# EAGLE design STM32F05_V2 (EAGLE 7.5.0)
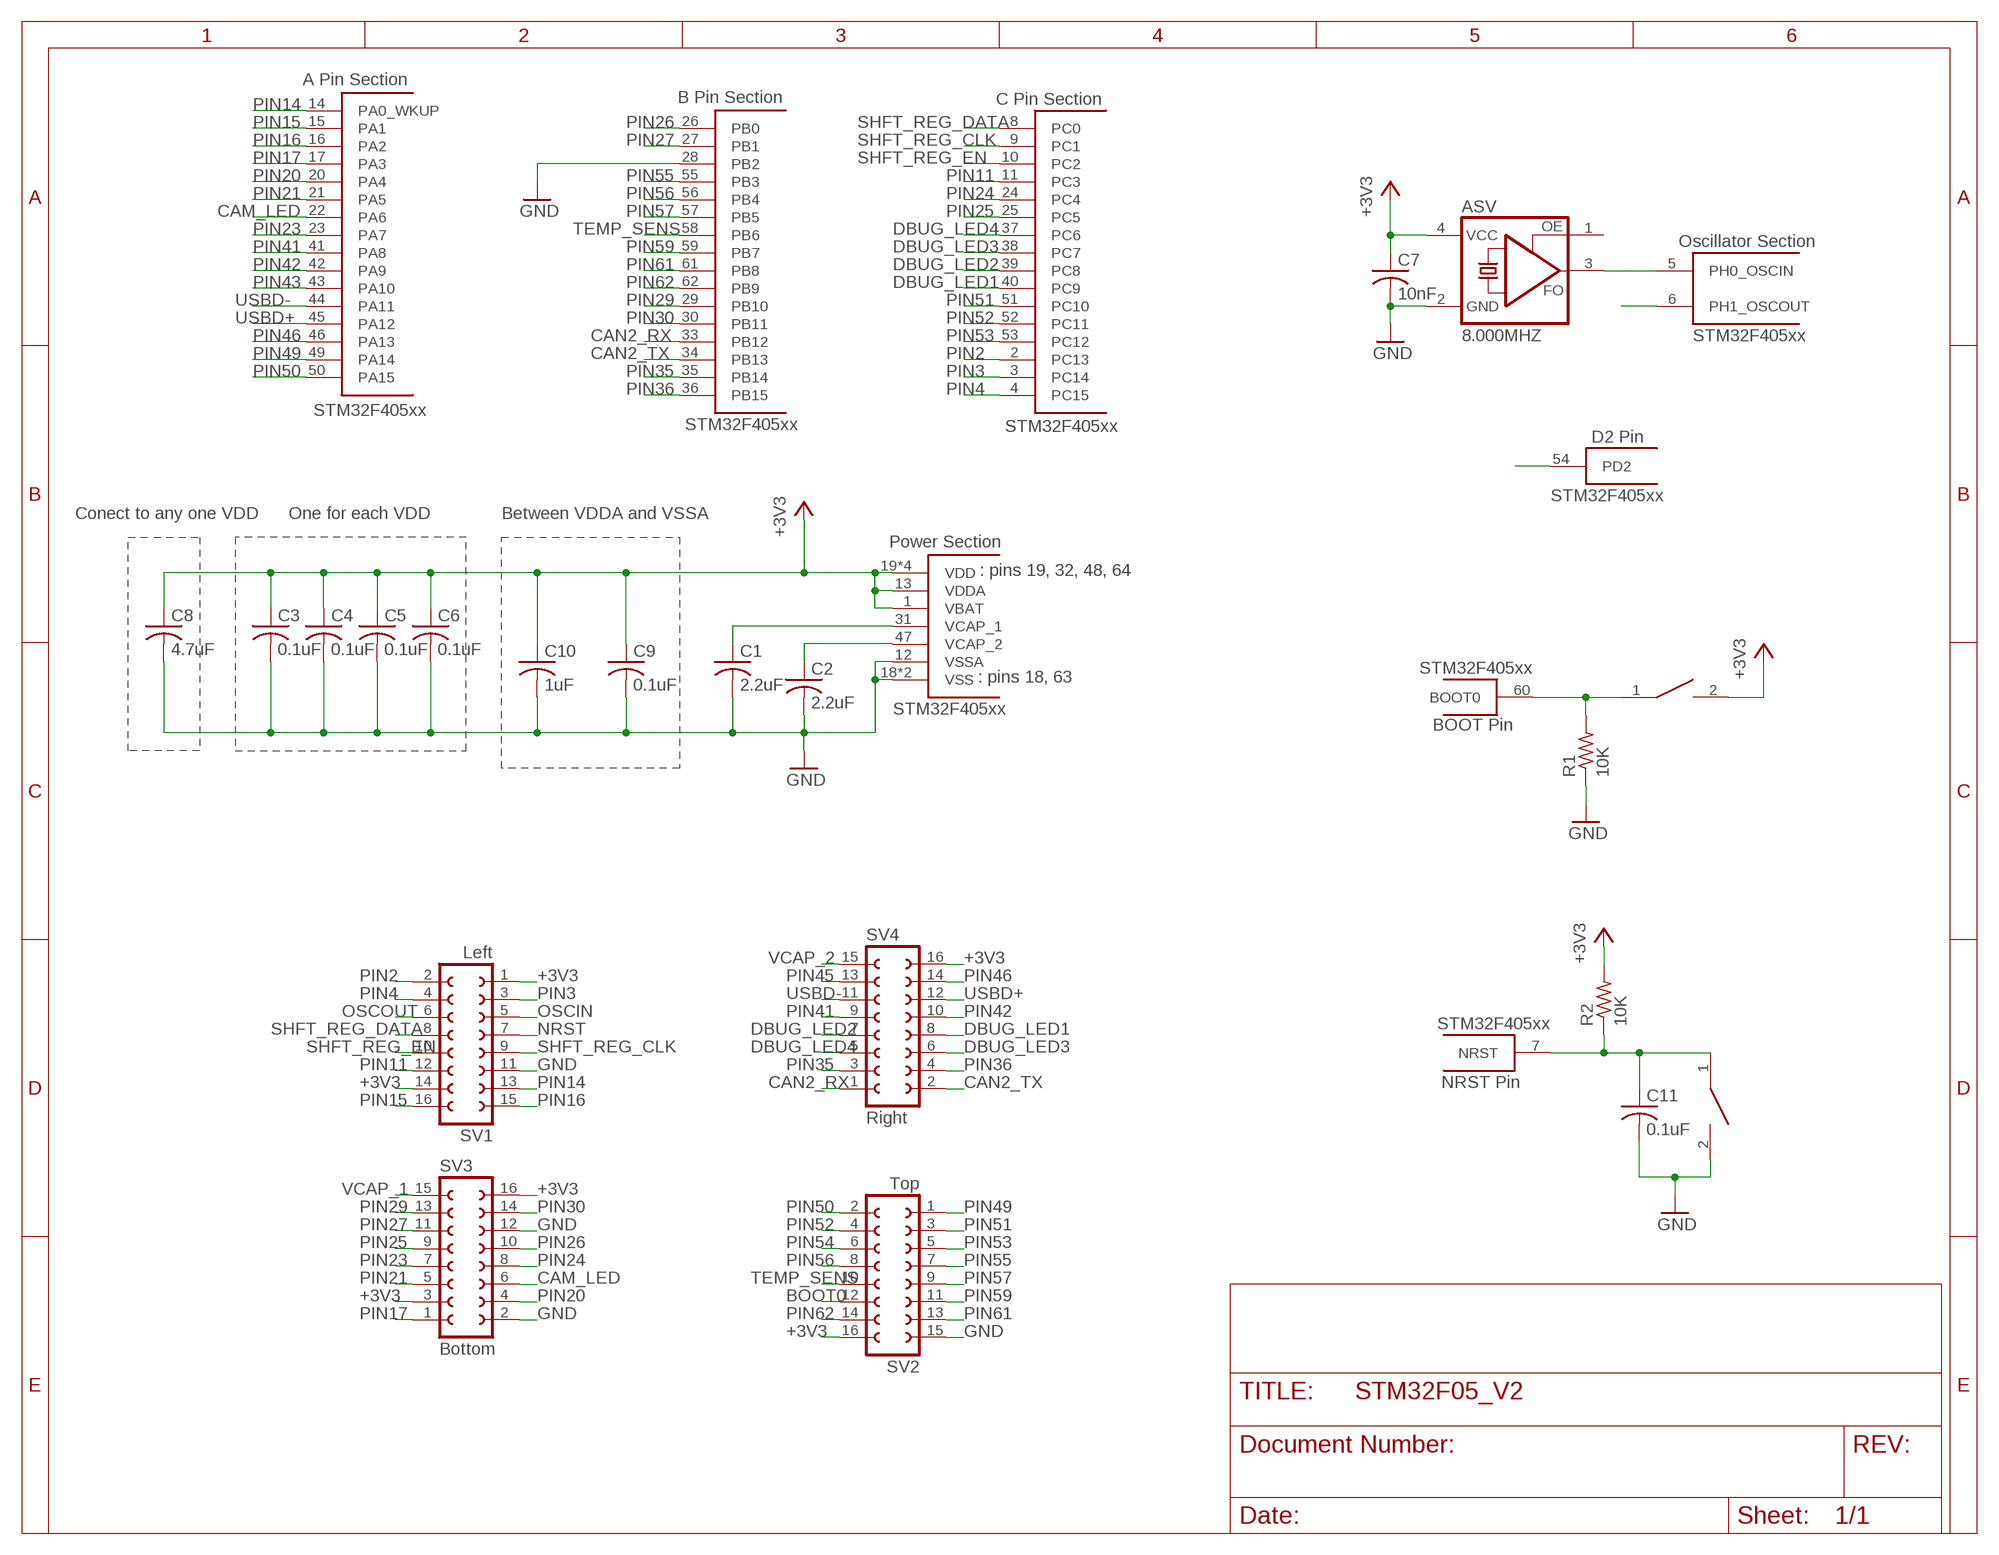
[diagram p0: schematic, sheet 1, part 1 of 2]
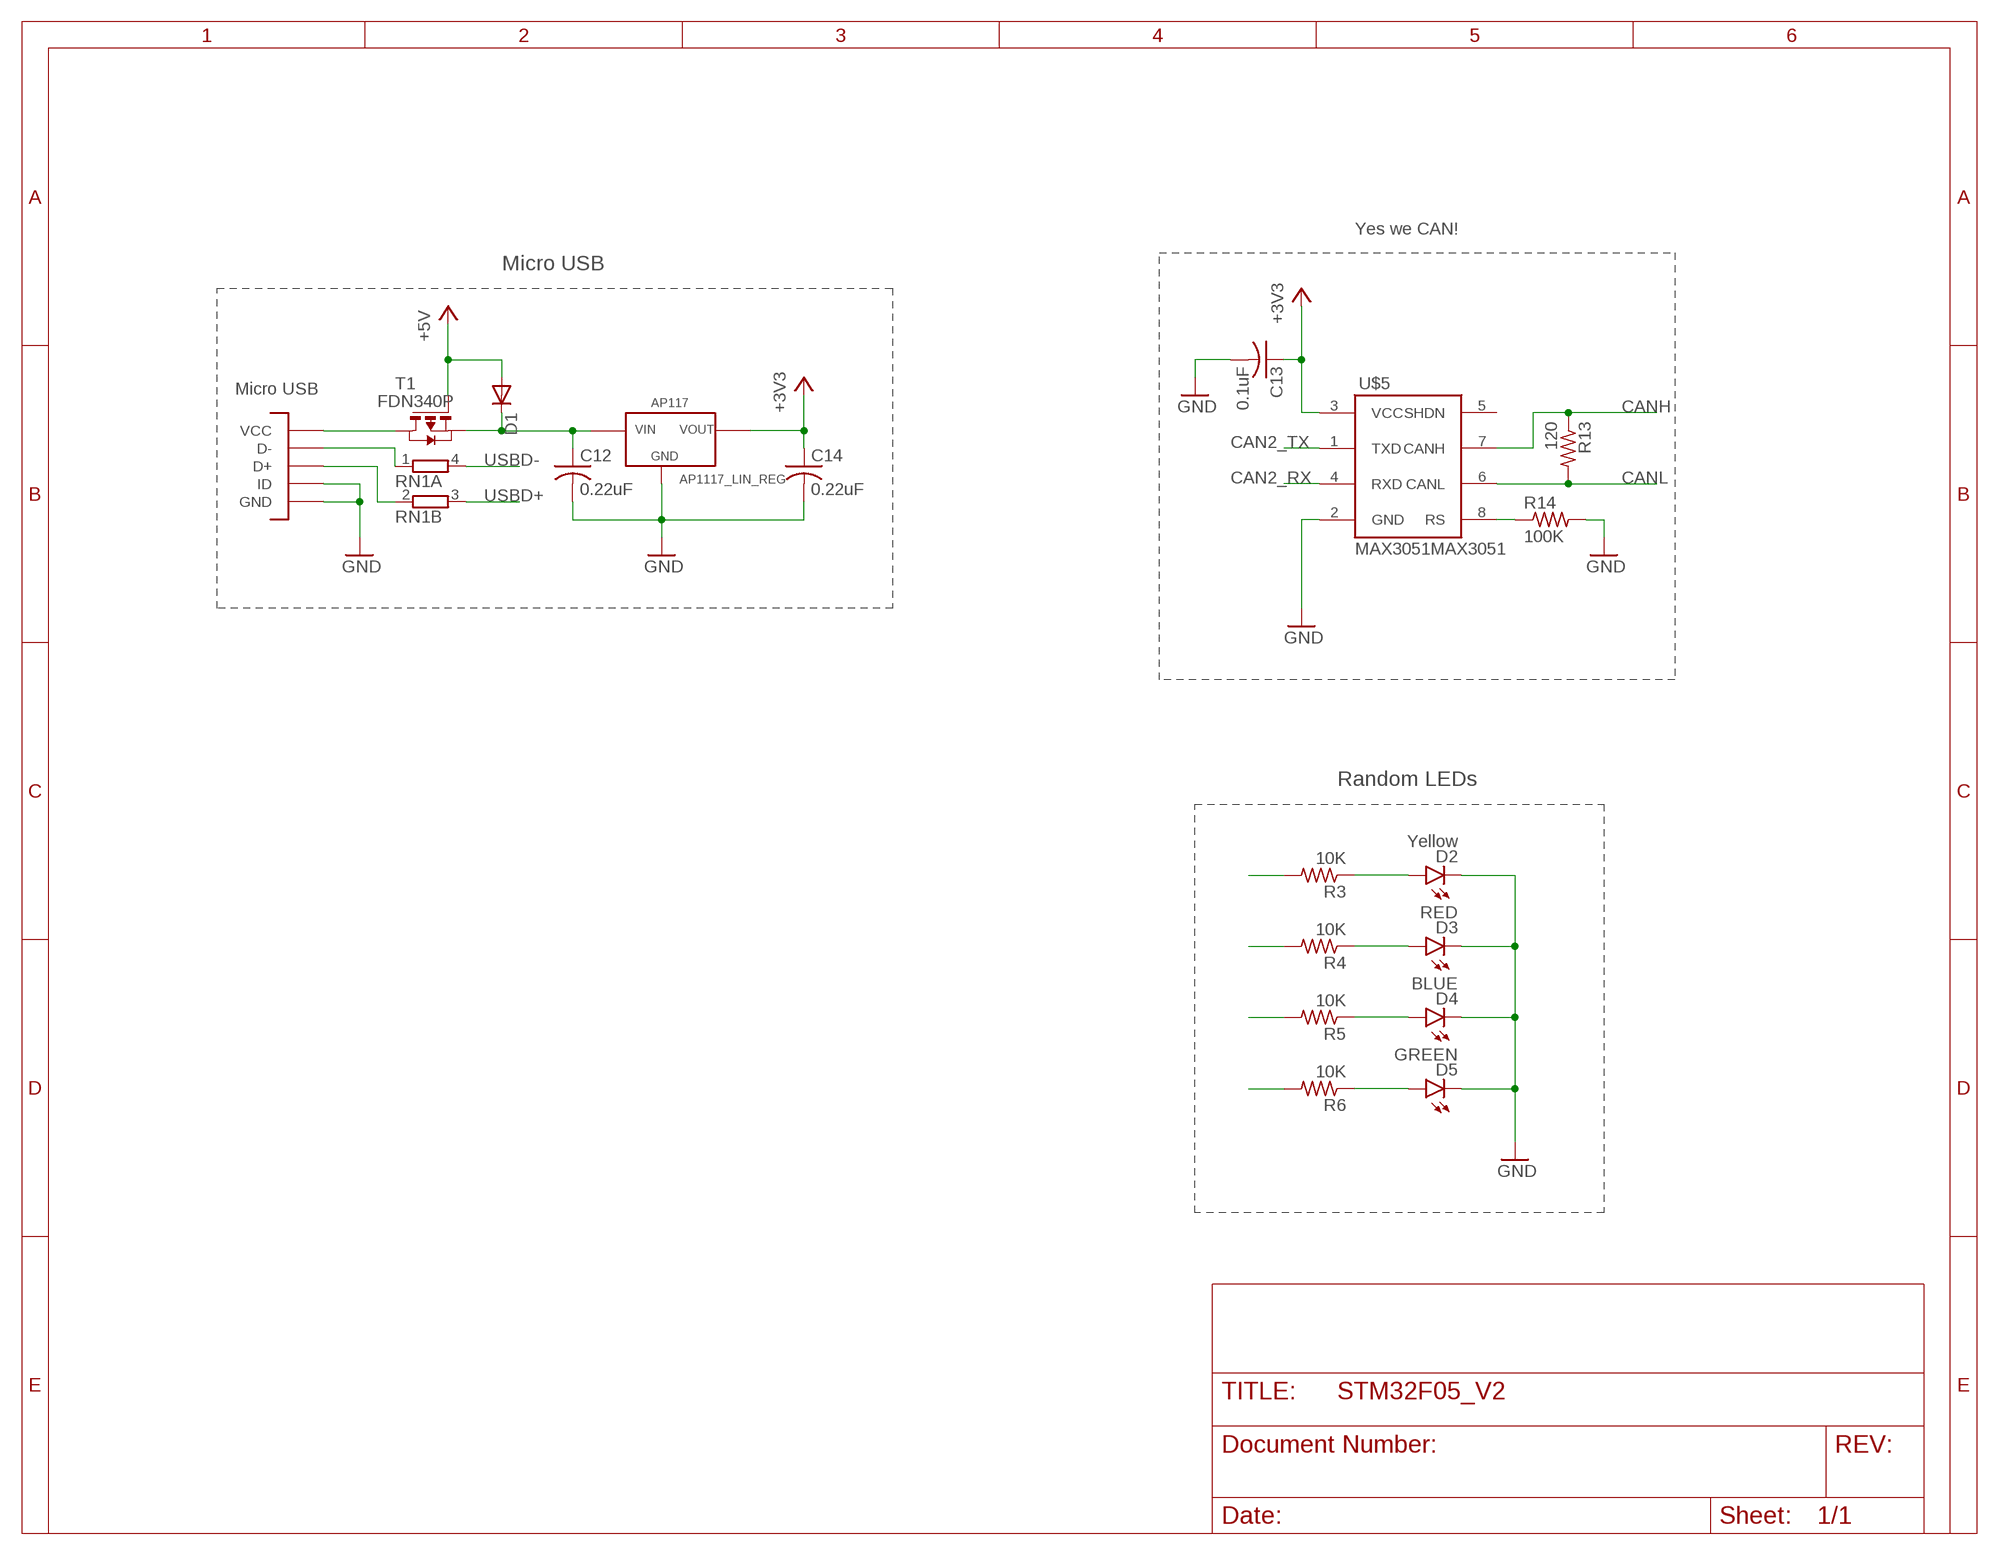
[diagram p1: schematic, sheet 1, part 2 of 2]

## Parts
ASV  8.000MHZ  ASF  [ASF]
C1  2.2uF  C-USC0603  [C0603]
C2  2.2uF  C-USC0603  [C0603]
C3  0.1uF  C-USC0603  [C0603]
C4  0.1uF  C-USC0603  [C0603]
C5  0.1uF  C-USC0603  [C0603]
C6  0.1uF  C-USC0603  [C0603]
C7  10nF  C-USC0603  [C0603]
C8  4.7uF  C-USC0603  [C0603]
C9  0.1uF  C-USC0603  [C0603]
C10  1uF  C-USC0603  [C0603]
C11  0.1uF  C-USC0603  [C0603]
C12  0.22uF  C-USC0603  [C0603]
C13  0.1uF  C-USC0603  [C0603]
C14  0.22uF  C-USC0603  [C0603]
D1  DIODE-DO-214AC  [DO-214AC]
D2  Yellow  LED-YELLOW0603  [LED-0603]
D3  RED  LED-RED0603  [LED-0603]
D4  BLUE  LED-BLUE0603  [LED-0603]
D5  GREEN  LED-GREEN0603  [LED-0603]
R1  10K  R-US_R0603  [R0603]
R2  10K  R-US_R0603  [R0603]
R3  10K  R-US_R0603  [R0603]
R4  10K  R-US_R0603  [R0603]
R5  10K  R-US_R0603  [R0603]
R6  10K  R-US_R0603  [R0603]
R13  120  R-US_R0603  [R0603]
R14  100K  R-US_R0603  [R0603]
RN1  2R-NEXBV4V  [EXBV4V]
SV1  Left  FE08-2  [FE08-2]
SV2  Top  FE08-2  [FE08-2]
SV3  Bottom  FE08-2  [FE08-2]
SV4  Right  FE08-2  [FE08-2]
T1  FDN340P  [SOT-23]
T2  AP1117_LIN_REG  [SOT223]
U$1  STM32F405  [LQFP64]
U$2  SWITCH  [SW_2512]
U$3  SWITCH  [SW_2512]
U$4  MICROUSB  [MICRO_B]
U$5  MAX3051MAX3051  [SOT23-8L]

## Nets
+3V3: ASV.4(VCC) C3.1 C4.1 C5.1 C6.1 C7.1 C8.1 C9.1 C10.1 C13.1 C14.1 R2.2 SV1.1 SV1.14 SV2.16 SV3.3 SV3.16 SV4.16 T2.TAB(VOUT) T2.VOUT U$1.1(VBAT) U$1.13(VDDA) U$1.19(VDD) U$1.32(VDD) U$1.48(VDD) U$1.64(VDD) U$2.2 U$5.3(VCC)
+5V: D1.A T1.3(G)
BOOT0: R1.2 SV2.12 U$1.60(BOOT0) U$2.1
CAM_LED: SV3.6 U$1.22(PA6)
CAN2_RX: SV4.1 U$1.33(PB12) U$5.4(RXD)
CAN2_TX: SV4.2 U$1.34(PB13) U$5.1(TXD)
CANH: R13.1 U$5.7(CANH)
CANL: R13.2 U$5.6(CANL)
DBUG_LED1: R3.2 SV4.8 U$1.40(PC9)
DBUG_LED2: R4.2 SV4.7 U$1.39(PC8)
DBUG_LED3: R5.2 SV4.6 U$1.38(PC7)
DBUG_LED4: R6.2 SV4.5 U$1.37(PC6)
GND: ASV.2(GND) C1.2 C2.2 C3.2 C4.2 C5.2 C6.2 C7.2 C8.2 C9.2 C10.2 C11.2 C12.2 C13.2 C14.2 D2.C D3.C D4.C D5.C R1.1 R14.2 SV1.11 SV2.15 SV3.2 SV3.12 T2.GND U$1.12(VSSA) U$1.18(VSS) U$1.28(PB2) U$1.63(VSS) U$3.2 U$4.GND1(GND) U$4.GND2(GND) U$4.GND3(GND) U$4.GND4(GND) U$4.GND7(GND) U$4.GND8(GND) U$4.P4(ID) U$4.P5(GND) U$5.2(GND)
N$1: RN1.1 U$4.P2(D-)
N$24: RN1.2 U$4.P3(D+)
N$57: T1.1(D) U$4.P1(VCC)
N$58: C12.1 D1.C T1.2(S) T2.VIN
N$59: D2.A R3.1
N$60: D3.A R4.1
N$61: D4.A R5.1
N$62: D5.A R6.1
N$63: R14.1 U$5.8(RS)
NRST: C11.1 R2.1 SV1.7 U$1.7(NRST) U$3.1
OSCIN: ASV.3(FO) SV1.5 U$1.5(PH0_OSCIN)
OSCOUT: SV1.6 U$1.6(PH1_OSCOUT)
PIN2: SV1.2 U$1.2(PC13)
PIN3: SV1.3 U$1.3(PC14)
PIN4: SV1.4 U$1.4(PC15)
PIN11: SV1.12 U$1.11(PC3)
PIN14: SV1.13 U$1.14(PA0_WKUP)
PIN15: SV1.16 U$1.15(PA1)
PIN16: SV1.15 U$1.16(PA2)
PIN17: SV3.1 U$1.17(PA3)
PIN20: SV3.4 U$1.20(PA4)
PIN21: SV3.5 U$1.21(PA5)
PIN23: SV3.7 U$1.23(PA7)
PIN24: SV3.8 U$1.24(PC4)
PIN25: SV3.9 U$1.25(PC5)
PIN26: SV3.10 U$1.26(PB0)
PIN27: SV3.11 U$1.27(PB1)
PIN29: SV3.13 U$1.29(PB10)
PIN30: SV3.14 U$1.30(PB11)
PIN35: SV4.3 U$1.35(PB14)
PIN36: SV4.4 U$1.36(PB15)
PIN41: SV4.9 U$1.41(PA8)
PIN42: SV4.10 U$1.42(PA9)
PIN43: U$1.43(PA10)
PIN45: SV4.13
PIN46: SV4.14 U$1.46(PA13)
PIN49: SV2.1 U$1.49(PA14)
PIN50: SV2.2 U$1.50(PA15)
PIN51: SV2.3 U$1.51(PC10)
PIN52: SV2.4 U$1.52(PC11)
PIN53: SV2.5 U$1.53(PC12)
PIN54: SV2.6 U$1.54(PD2)
PIN55: SV2.7 U$1.55(PB3)
PIN56: SV2.8 U$1.56(PB4)
PIN57: SV2.9 U$1.57(PB5)
PIN59: SV2.11 U$1.59(PB7)
PIN61: SV2.13 U$1.61(PB8)
PIN62: SV2.14 U$1.62(PB9)
SHFT_REG_CLK: SV1.9 U$1.9(PC1)
SHFT_REG_DATA: SV1.8 U$1.8(PC0)
SHFT_REG_EN: SV1.10 U$1.10(PC2)
TEMP_SENS: SV2.10 U$1.58(PB6)
USBD+: RN1.3 SV4.12 U$1.45(PA12)
USBD-: RN1.4 SV4.11 U$1.44(PA11)
VCAP_1: C1.1 SV3.15 U$1.31(VCAP_1)
VCAP_2: C2.1 SV4.15 U$1.47(VCAP_2)
Unconnected: ASV.1(OE) U$5.5(SHDN)

## Notes on the sheet
- Yes we CAN!
- Micro USB
- Micro USB
- Conect to any one VDD | One for each VDD | Between VDDA and VSSA
- : pins 19, 32, 48, 64
- : pins 18, 63
- Random LEDs

## Library data of the parts
ASV = DiscreteComponents:ASF*: CRYSTAL CLOCK OSCILLATORS 5.0 Vdc or 3.3 Vdc - LOW PROFILE ULTRA MINIATURE CERAMIC SURFACE MOUNT Source: http://www.abracon.com/Oscillators/asf1-L-L1.pdf; DIGIKEY: 535-10066-1-ND
C1-C14 = rcl:C-US: CAPACITOR, American symbol
D1 = DiscreteComponents:DIODE-: DIODE
D2 = SparkFun-LED:LED-YELLOW: Yellow SMD LEDs LilyPad 1206- DIO-09909 0603- DIO-09003 "SMART" means more efficient and expensive; PROD_ID: DIO-09003
D3 = SparkFun-LED:LED-RED: Assorted Red LEDs LilyPad 1206- DIO-09912 1206- DIO-00809 0603- DIO-00819 "SMART" means more efficient and expensive; PROD_ID: DIO-00819
D4 = SparkFun-LED:LED-BLUE: Blue LEDs for production use Various blue LEDs stocked by SparkFun production 0603 - DIO-08575 Rebel - DIO-09553 1206 - DIO-09911; PROD_ID: DIO-08575
D5 = SparkFun-LED:LED-GREEN: Various green LEDs Green LEDs used in SFE Production 0603- DIO-00821 LARGE- DIO-00862 LILYPAD- DIO-09910; PROD_ID: DIO-00821
R1-R6 R13 R14 = rcl:R-US_: RESISTOR, American symbol
RN1 = DiscreteComponents:2R-N: Array Chip Resistor; DIGIKEY: RHM1381CT-ND; MF: Rohm Semiconductor; MPN: MNR12ERAPJ220
SV1-SV4 = con-lsta:FE08-2: FEMALE HEADER; OC_FARNELL: unknown; OC_NEWARK: unknown
T1 = DiscreteComponents:FDN340P: MOS FET; DIGIKEY: FDN340PCT-ND
T2 = PowerComponents:AP1117_LIN_REG
U$1 = Other:STM32F405
U$2 U$3 = DiscreteComponents:SWITCH
U$4 = Other:MICROUSB
U$5 = MAX3051 Library:MAX3051: Maxim Integrated MAX3051 CAN Tranciever

## Board
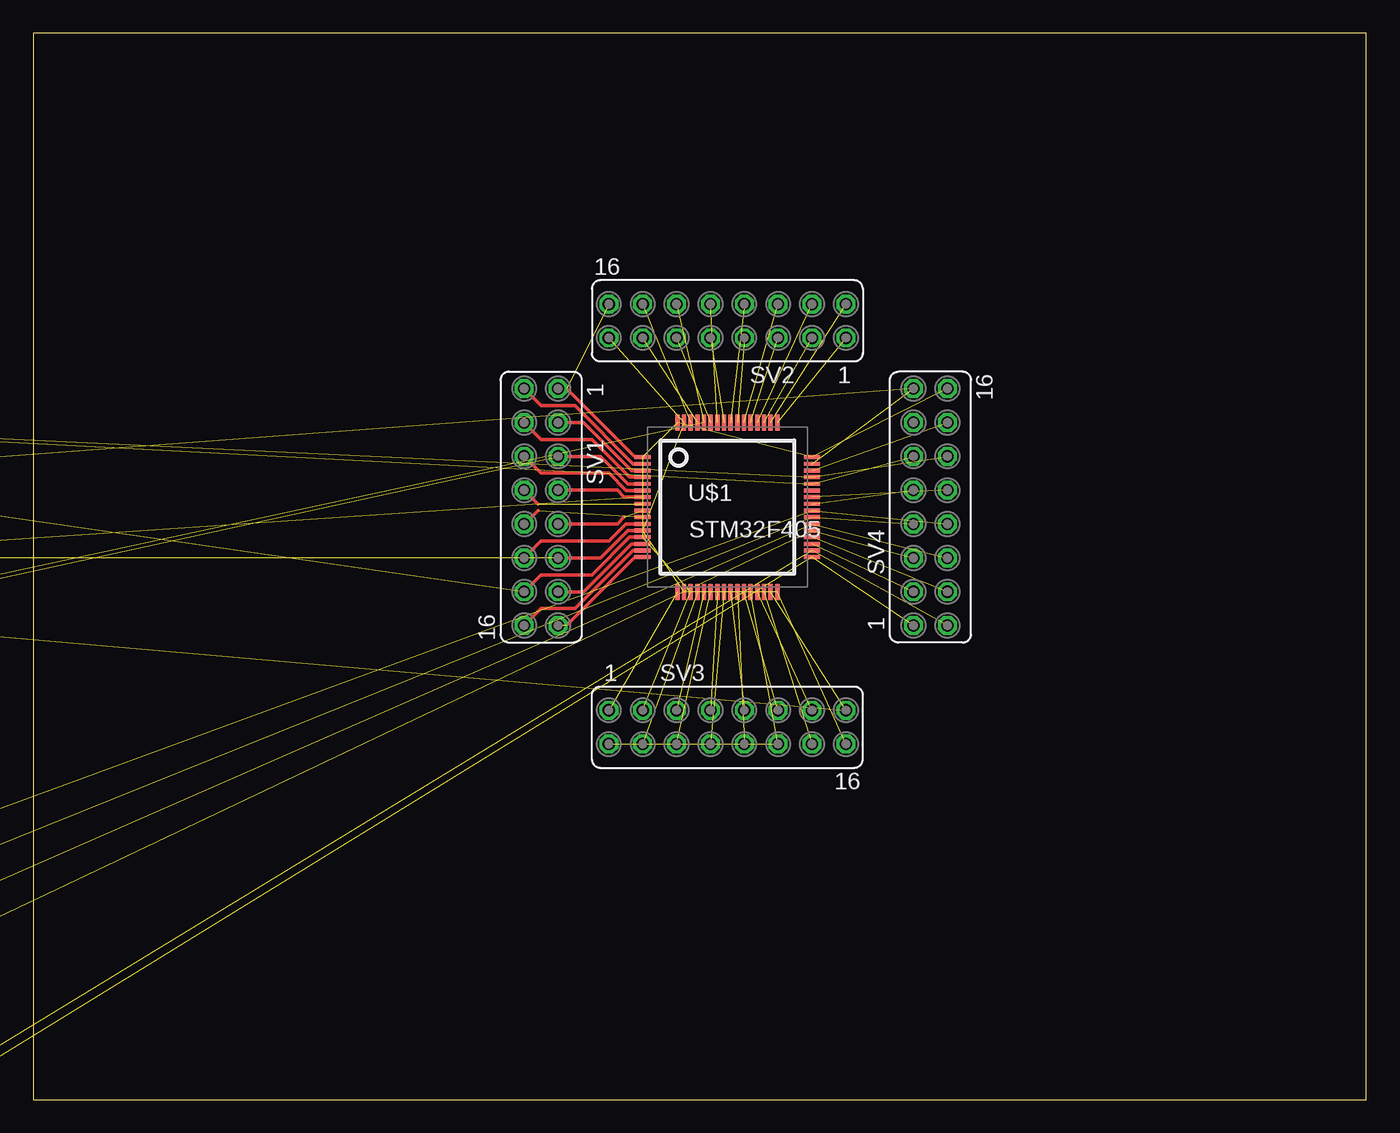
[diagram p2: board, top side]

Size 100 x 80 mm. Coordinates in mm from the lower left corner, seen from the top.
Outline: 0,0 100,0 100,80 0,80 0,0
Copper layers (1*16): Top 0.035mm / dielectric 1.5mm / Bottom 0.035mm
Design rules "default": minimum track width 10mil, minimum drill 24mil, track to track 8mil, track to pad 8mil, pad to pad 8mil, via to via 8mil, smd to smd 8mil, copper to edge 40mil, drill to drill 8mil, minimum pad ring 10mil, minimum via ring 8mil, stop-mask expansion 4mil, vias tented up to drill 0mil, thermal gap 10mil

### Footprints (pad centres in the part's own frame; a part is rotated, then mirrored left to right if it is on the bottom)
ASF = smd 1.6 x 1.5: 1 -1.25,-1.15; 2 1.25,-1.15; 3 1.25,1.15; 4 -1.25,1.15
C0603 = smd 1.1 x 1: 1 -0.85,0; 2 0.85,0
DO-214AC = smd 1.8 x 2.4: A 2.025,0; C -2.025,0
LED-0603 = smd 1 x 1: A 0,-0.877; C 0,0.877
R0603 = smd 1 x 1.1: 1 -0.85,0; 2 0.85,0
EXBV4V = smd 0.45 x 0.7: 1 -0.4,-0.775; 2 0.4,-0.775; 3 0.4,0.775; 4 -0.4,0.775
FE08-2 = drill 0.914 octagon: 1 -8.89,1.27; 2 -8.89,-1.27; 3 -6.35,1.27; 4 -6.35,-1.27; 5 -3.81,1.27; 6 -3.81,-1.27; 7 -1.27,1.27; 8 -1.27,-1.27; 9 1.27,1.27; 10 1.27,-1.27; 11 3.81,1.27; 12 3.81,-1.27; 13 6.35,1.27; 14 6.35,-1.27; 15 8.89,1.27; 16 8.89,-1.27
SOT-23 = smd 0.787 x 0.889: 1 0.025,-1.016; 2 -0.94,1.016; 3 0.991,1.016
SOT223 = smd 1.2 x 1.6: GND -2.3,-3.2; VIN 2.3,-3.2; VOUT 0,-3.2 | smd 3.3 x 1.6: TAB 0,3.2
LQFP64 = smd 1.2 x 0.3: 1 -6.35,3.75; 2 -6.35,3.25; 3 -6.35,2.75; 4 -6.35,2.25; 5 -6.35,1.75; 6 -6.35,1.25; 7 -6.35,0.75; 8 -6.35,0.25; 9 -6.35,-0.25; 10 -6.35,-0.75; 11 -6.35,-1.25; 12 -6.35,-1.75; 13 -6.35,-2.25; 14 -6.35,-2.75; 15 -6.35,-3.25; 16 -6.35,-3.75; 33 6.35,-3.75; 34 6.35,-3.25; 35 6.35,-2.75; 36 6.35,-2.25; 37 6.35,-1.75; 38 6.35,-1.25; 39 6.35,-0.75; 40 6.35,-0.25; 41 6.35,0.25; 42 6.35,0.75; 43 6.35,1.25; 44 6.35,1.75; 45 6.35,2.25; 46 6.35,2.75; 47 6.35,3.25; 48 6.35,3.75 | smd 0.3 x 1.2: 17 -3.75,-6.35; 18 -3.25,-6.35; 19 -2.75,-6.35; 20 -2.25,-6.35; 21 -1.75,-6.35; 22 -1.25,-6.35; 23 -0.75,-6.35; 24 -0.25,-6.35; 25 0.25,-6.35; 26 0.75,-6.35; 27 1.25,-6.35; 28 1.75,-6.35; 29 2.25,-6.35; 30 2.75,-6.35; 31 3.25,-6.35; 32 3.75,-6.35; 49 3.75,6.35; 50 3.25,6.35; 51 2.75,6.35; 52 2.25,6.35; 53 1.75,6.35; 54 1.25,6.35; 55 0.75,6.35; 56 0.25,6.35; 57 -0.25,6.35; 58 -0.75,6.35; 59 -1.25,6.35; 60 -1.75,6.35; 61 -2.25,6.35; 62 -2.75,6.35; 63 -3.25,6.35; 64 -3.75,6.35
SW_2512 = smd 1.8 x 3.2: 1 -2.8,0; 2 2.8,0
MICRO_B = smd 1.5 x 1.55: GND1 -1,1.45; GND2 1,1.45 | drill 0.8: GND3 -2.5,4.15; GND4 2.5,4.15 | drill 1.15: GND7 -3.598,1.45; GND8 3.598,1.45 | smd 0.4 x 1.35: P1 -1.3,4.15; P2 -0.65,4.15; P3 0,4.15; P4 0.65,4.15; P5 1.3,4.15
SOT23-8L = smd 0.45 x 1: 1 -0.975,-1.225; 2 -0.325,-1.225; 3 0.325,-1.225; 4 0.975,-1.225; 5 0.975,1.225; 6 0.325,1.225; 7 -0.325,1.225; 8 -0.975,1.225

### Placement (x,y rotation side)
ASV  -38.1,30.48 0 top  (outside the outline)
C1  -54.61,39.37 0 top  (outside the outline)
C2  -17.78,46.99 0 top  (outside the outline)
C3  -24.13,46.99 0 top  (outside the outline)
C4  -30.48,46.99 0 top  (outside the outline)
C5  -36.83,46.99 0 top  (outside the outline)
C6  -43.18,46.99 0 top  (outside the outline)
C7  -24.13,52.07 0 top  (outside the outline)
C8  -49.53,46.99 0 top  (outside the outline)
C9  -55.88,46.99 0 top  (outside the outline)
C10  -29.21,52.07 0 top  (outside the outline)
C11  -17.78,52.07 0 top  (outside the outline)
C12  -77.47,-95.25 0 top  (outside the outline)
C13  -69.85,-90.17 0 top  (outside the outline)
C14  -77.47,-100.33 0 top  (outside the outline)
D1  -46.99,39.37 0 top  (outside the outline)
D2  -59.69,2.54 0 top  (outside the outline)
D3  -63.5,2.54 0 top  (outside the outline)
D4  -67.31,2.54 0 top  (outside the outline)
D5  -71.12,2.54 0 top  (outside the outline)
R1  -34.29,52.07 0 top  (outside the outline)
R2  -39.37,52.07 0 top  (outside the outline)
R3  -69.85,-2.54 0 top  (outside the outline)
R4  -69.85,-7.62 0 top  (outside the outline)
R5  -69.85,-12.7 0 top  (outside the outline)
R6  -69.85,-17.78 0 top  (outside the outline)
R13  -69.85,-80.01 0 top  (outside the outline)
R14  -69.85,-85.09 0 top  (outside the outline)
RN1  -44.45,50.8 0 top  (outside the outline)
SV1  38.1,44.45 270 top
SV2  52.07,58.42 180 top
SV3  52.07,27.94 0 top
SV4  67.31,44.45 90 top
T1  -30.48,39.37 0 top  (outside the outline)
T2  -76.2,-87.63 0 top  (outside the outline)
U$1  52.07,44.45 0 top
U$2  -46.99,29.21 0 top  (outside the outline)
U$3  -19.05,40.64 0 top  (outside the outline)
U$4  -38.1,38.1 0 top  (outside the outline)
U$5  -68.58,-35.56 0 top  (outside the outline)

### Tracks (layer width: path | path; a pad name or v marks a point on that pad's centre or on a via)
+3V3  (25 unrouted)
  Top 0.254: U$1.1 45.15,48.2 40.01,53.34 SV1.1 | U$1.13 44.74,42.2 41.91,39.37 38.1,39.37 SV1.14
+5V  (1 unrouted)
BOOT0  (3 unrouted)
CAM_LED  (1 unrouted)
CAN2_RX  (2 unrouted)
CAN2_TX  (2 unrouted)
CANH  (1 unrouted)
CANL  (1 unrouted)
DBUG_LED1  (2 unrouted)
DBUG_LED2  (2 unrouted)
DBUG_LED3  (2 unrouted)
DBUG_LED4  (2 unrouted)
GND  (38 unrouted)
  Top 0.254: U$1.12 44.6,42.7 42.55,40.64 SV1.11
N$1  (1 unrouted)
N$24  (1 unrouted)
N$57  (1 unrouted)
N$58  (3 unrouted)
N$59  (1 unrouted)
N$60  (1 unrouted)
N$61  (1 unrouted)
N$62  (1 unrouted)
N$63  (1 unrouted)
NRST  (3 unrouted)
  Top 0.254: U$1.7 44.34,45.2 43.81,45.72 SV1.7
OSCIN  (1 unrouted)
  Top 0.254: U$1.5 44.6,46.2 42.55,48.26 SV1.5
OSCOUT
  Top 0.254: U$1.6 44.47,45.7 43.18,46.99 38.1,46.99 SV1.6
PIN2
  Top 0.254: U$1.2 45.01,47.7 40.64,52.07 38.1,52.07 SV1.2
PIN3
  Top 0.254: U$1.3 44.88,47.2 41.27,50.8 SV1.3
PIN4
  Top 0.254: U$1.4 44.74,46.7 41.91,49.53 38.1,49.53 SV1.4
PIN11
  Top 0.254: U$1.11 44.47,43.2 43.18,41.91 38.1,41.91 SV1.12
PIN14
  Top 0.254: U$1.14 44.88,41.7 41.27,38.1 SV1.13
PIN15
  Top 0.254: U$1.15 45.01,41.2 40.64,36.83 38.1,36.83 SV1.16
PIN16  (1 unrouted)
  Top 0.254: U$1.16 45.15,40.7 40.01,35.56
PIN17  (1 unrouted)
PIN20  (1 unrouted)
PIN21  (1 unrouted)
PIN23  (1 unrouted)
PIN24  (1 unrouted)
PIN25  (1 unrouted)
PIN26  (1 unrouted)
PIN27  (1 unrouted)
PIN29  (1 unrouted)
PIN30  (1 unrouted)
PIN35  (1 unrouted)
PIN36  (1 unrouted)
PIN41  (1 unrouted)
PIN42  (1 unrouted)
PIN46  (1 unrouted)
PIN49  (1 unrouted)
PIN50  (1 unrouted)
PIN51  (1 unrouted)
PIN52  (1 unrouted)
PIN53  (1 unrouted)
PIN54  (1 unrouted)
PIN55  (1 unrouted)
PIN56  (1 unrouted)
PIN57  (1 unrouted)
PIN59  (1 unrouted)
PIN61  (1 unrouted)
PIN62  (1 unrouted)
SHFT_REG_CLK  (1 unrouted)
  Top 0.254: 44.34,43.7 43.81,43.18 SV1.9
SHFT_REG_DATA  (1 unrouted)
  Top 0.254: 37.85,44.7 SV1.8
SHFT_REG_EN  (1 unrouted)
  Top 0.254: 37.85,44.2 SV1.10
TEMP_SENS  (1 unrouted)
USBD+  (2 unrouted)
USBD-  (2 unrouted)
VCAP_1  (2 unrouted)
VCAP_2  (2 unrouted)